# Altium schematic sheet SNES_DRONE_LEVEL_SHIFTER.SchDoc
size A4
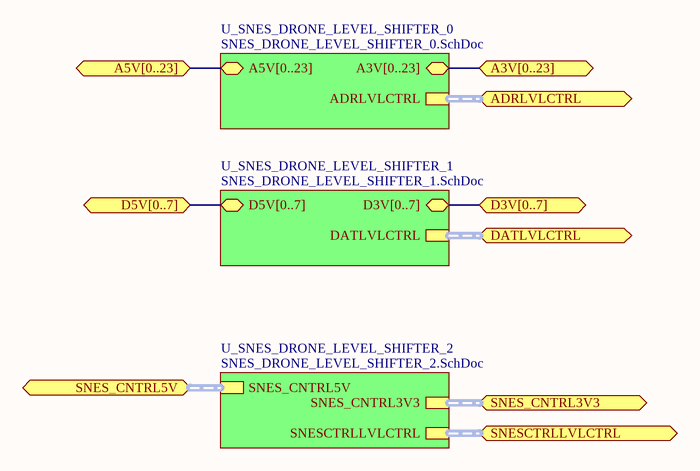
[diagram p0: SNES_DRONE_LEVEL_SHIFTER.SchDoc]

## Sub-sheets
U_SNES_DRONE_LEVEL_SHIFTER_0 = SNES_DRONE_LEVEL_SHIFTER_0.SchDoc: A5V[0..23] (bidir), A3V[0..23] (bidir), ADRLVLCTRL (harness ADRLVLCTRL)
U_SNES_DRONE_LEVEL_SHIFTER_1 = SNES_DRONE_LEVEL_SHIFTER_1.SchDoc: D5V[0..7] (bidir), D3V[0..7] (bidir), DATLVLCTRL (harness DATLVLCTRL)
U_SNES_DRONE_LEVEL_SHIFTER_2 = SNES_DRONE_LEVEL_SHIFTER_2.SchDoc: SNES_CNTRL5V (harness SNES_CNTRL5V), SNES_CNTRL3V3 (harness SNES_CNTRL3V3), SNESCTRLLVLCTRL (harness SNESCTRLLVLCTRL)

## Ports
A3V[0..23] (bidir), A5V[0..23] (bidir), ADRLVLCTRL (bidir, harness ADRLVLCTRL), D3V[0..7] (bidir), D5V[0..7] (bidir), DATLVLCTRL (bidir, harness DATLVLCTRL), SNES_CNTRL3V3 (bidir, harness SNES_CNTRL3V3), SNES_CNTRL5V (bidir, harness SNES_CNTRL5V), SNESCTRLLVLCTRL (bidir, harness SNESCTRLLVLCTRL)

## Buses and harness runs
bus port A3V[0..23] = sheet U_SNES_DRONE_LEVEL_SHIFTER_0/A3V[0..23]
bus port A5V[0..23] = sheet U_SNES_DRONE_LEVEL_SHIFTER_0/A5V[0..23]
bus port D3V[0..7] = sheet U_SNES_DRONE_LEVEL_SHIFTER_1/D3V[0..7]
bus port D5V[0..7] = sheet U_SNES_DRONE_LEVEL_SHIFTER_1/D5V[0..7]
harness port ADRLVLCTRL = sheet U_SNES_DRONE_LEVEL_SHIFTER_0/ADRLVLCTRL
harness port DATLVLCTRL = sheet U_SNES_DRONE_LEVEL_SHIFTER_1/DATLVLCTRL
harness port SNES_CNTRL3V3 = sheet U_SNES_DRONE_LEVEL_SHIFTER_2/SNES_CNTRL3V3
harness port SNES_CNTRL5V = sheet U_SNES_DRONE_LEVEL_SHIFTER_2/SNES_CNTRL5V
harness port SNESCTRLLVLCTRL = sheet U_SNES_DRONE_LEVEL_SHIFTER_2/SNESCTRLLVLCTRL